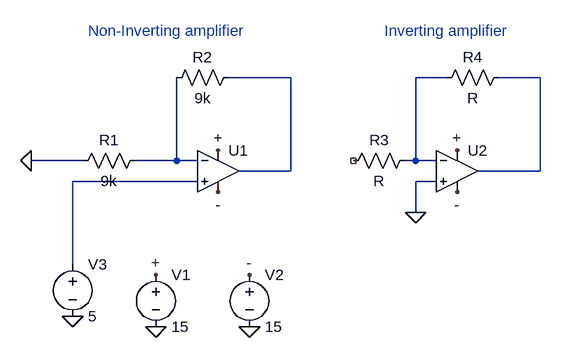
[diagram p0: schematic Draft3.asc]
Draft3.asc, the LTspice schematic file:
Version 4
SHEET 1 880 680
WIRE 384 32 288 32
WIRE 624 32 576 32
WIRE 768 32 704 32
WIRE 64 160 -16 160
WIRE 208 160 208 32
WIRE 208 160 144 160
WIRE 240 160 208 160
WIRE 576 160 576 32
WIRE 576 160 560 160
WIRE 608 160 576 160
WIRE 384 176 384 32
WIRE 384 176 304 176
WIRE 768 176 768 32
WIRE 768 176 672 176
WIRE 240 192 48 192
WIRE 608 192 576 192
WIRE 576 240 576 192
WIRE 48 320 48 192
FLAG 176 416 0
FLAG 320 416 0
FLAG 272 144 +
FLAG 640 144 +
FLAG 176 336 +
FLAG 320 336 -
FLAG 272 208 -
FLAG 640 208 -
FLAG 48 400 0
FLAG -16 160 0
FLAG 576 240 0
SYMBOL Opamps\\UniversalOpamp2 272 176 R0
SYMATTR InstName U1
SYMBOL Opamps\\UniversalOpamp2 640 176 R0
SYMATTR InstName U2
SYMBOL voltage 176 320 R0
WINDOW 123 0 0 Left 0
WINDOW 39 0 0 Left 0
SYMATTR InstName V1
SYMATTR Value 15
SYMBOL voltage 320 320 R0
WINDOW 123 0 0 Left 0
WINDOW 39 0 0 Left 0
SYMATTR InstName V2
SYMATTR Value 15
SYMBOL res 160 144 R90
WINDOW 0 0 56 VBottom 2
WINDOW 3 32 56 VTop 2
SYMATTR InstName R1
SYMATTR Value 9k
SYMBOL res 304 16 R90
WINDOW 0 0 56 VBottom 2
WINDOW 3 32 56 VTop 2
SYMATTR InstName R2
SYMATTR Value 9k
SYMBOL voltage 48 304 R0
WINDOW 123 0 0 Left 0
WINDOW 39 0 0 Left 0
SYMATTR InstName V3
SYMATTR Value 5
SYMBOL res 576 144 R90
WINDOW 0 0 56 VBottom 2
WINDOW 3 32 56 VTop 2
SYMATTR InstName R3
SYMBOL res 720 16 R90
WINDOW 0 0 56 VBottom 2
WINDOW 3 32 56 VTop 2
SYMATTR InstName R4
TEXT 528 -40 Left 2 ;Inverting amplifier
TEXT 72 -40 Left 2 ;Non-Inverting amplifier

The netlist it stands for:
* Draft3.asc
XU1 N005 N004 + - N001 level.2 Avol=1Meg GBW=10Meg Slew=10Meg ilimit=25m rail=0 Vos=0 phimargin=45 en=0 enk=0 in=0 ink=0 Rin=500Meg  ; pins IN+ IN- V+ V- OUT
XU2 0 N002 + - N003 level.2 Avol=1Meg GBW=10Meg Slew=10Meg ilimit=25m rail=0 Vos=0 phimargin=45 en=0 enk=0 in=0 ink=0 Rin=500Meg  ; pins IN+ IN- V+ V- OUT
V1 + 0 15
V2 - 0 15
R1 N004 0 9k
R2 N001 N004 9k
V3 N005 0 5
R3 N002 NC_01 R
R4 N003 N002 R
* Inverting amplifier
* Non-Inverting amplifier
.lib UniversalOpamps2.sub
.backanno
.end